# EAGLE schematic microSD-adapter (EAGLE 7.5.0)
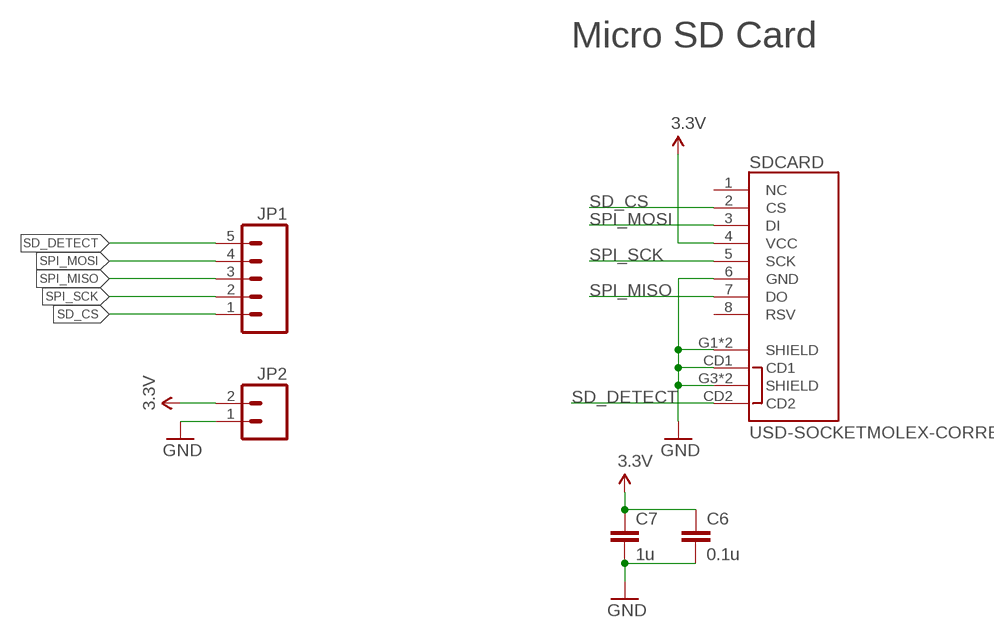
[diagram p0: schematic, sheet 1]

## Parts
C6  0.1u  C-EUC0805  [C0805]
C7  1u  C-EUC0805  [C0805]
JP1  M05PTH  [1X05]
JP2  M02PTH  [1X02]
SDCARD  USD-SOCKETMOLEX-CORRECT  [MICRO-SD-MOLEX-CORRECT]

## Nets
3.3V: C6.1 C7.1 JP2.2 SDCARD.4(VCC)
GND: C6.2 C7.2 JP2.1 SDCARD.6(GND) SDCARD.CD1 SDCARD.G1(SHIELD) SDCARD.G2(SHIELD) SDCARD.G3(SHIELD) SDCARD.G4(SHIELD)
SD_CS: JP1.1 SDCARD.2(CS)
SD_DETECT: JP1.5 SDCARD.CD2
SPI_MISO: JP1.3 SDCARD.7(DO)
SPI_MOSI: JP1.4 SDCARD.3(DI)
SPI_SCK: JP1.2 SDCARD.5(SCK)
Unconnected: SDCARD.1(NC) SDCARD.8(RSV)

## Notes on the sheet
- Micro SD Card

## Library data of the parts
C6 = rcl:C-EU: CAPACITOR, European symbol; PARTNO: 08055C104KAT2A
C7 = rcl:C-EU: CAPACITOR, European symbol; PARTNO: CC0805KKX7R7BB105
JP1 = SparkFun-Connectors:M05: Header 5 Standard 5-pin 0.1" header. Use with straight break away headers (SKU : PRT-00116), right angle break away headers (PRT-00553), swiss pins (PRT-00743), machine pins (PRT-00117), and female headers (PRT-00115). Molex polarized connector foot print use with SKU : PRT-08230 with associated crimp pins and housings.
JP2 = SparkFun-Connectors:M02: Standard 2-pin 0.1" header. Use with - straight break away headers ( PRT-00116) - right angle break away headers (PRT-00553) - swiss pins (PRT-00743) - machine pins (PRT-00117) - female headers (PRT-00115) Molex polarized connector foot print use with: PRT-08233 with associated crimp pins and housings. 2.54_SCREWTERM for use with PRT-10571. 3.5mm Screw Terminal footprints for PRT-08084 5mm Screw Terminal footprints for use with PRT-08432
SDCARD = MuniRent:USD-SOCKET: microSD Socket Push-push type uSD socket. Schematic element and footprint production proven. Spark Fun Electronics SKU : PRT-00127. tDoc lines correctly indicate media card edge positions when inserting (unlocked, locked, depressed). NOTE: CD1 and CD2 are connected internally; PARTNO: 1040310811

## Net classes
0 default: width 0.254 mm